# Altium project MotorPower.PrjPcb
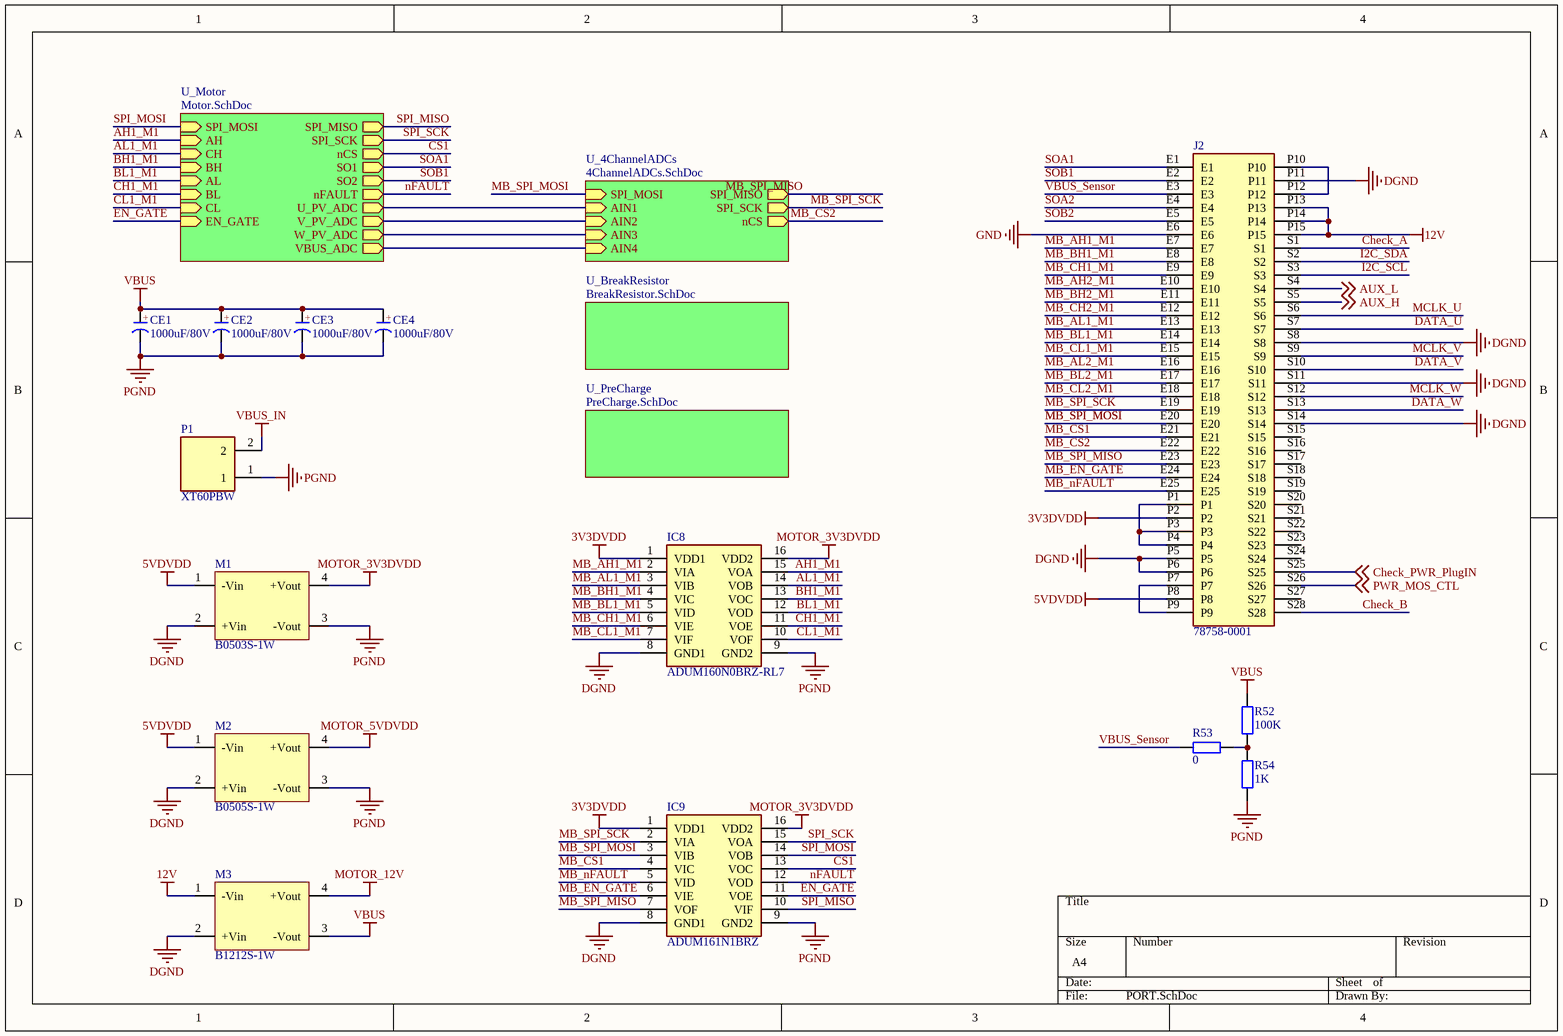
[diagram p0: PORT.SchDoc]
5 sheets, 199 parts. Net scope: hierarchical (ports join the sheet entries above them; power ports are global).
Board file: PowerModule.PcbDoc
Sheets:
  PORT.SchDoc
    U_Motor = Motor.SchDoc
    U_4ChannelADCs = 4ChannelADCs.SchDoc
    U_BreakResistor = BreakResistor.SchDoc
    U_PreCharge = PreCharge.SchDoc

## Sheet PORT.SchDoc
size A4; SheetNumber: 1; SheetTotal: 5

### Parts
CE1  1000uF/80V  [CAP 7.5*18*35.5 - BK]
CE2  1000uF/80V  [CAP 7.5*18*35.5 - BK]
CE3  1000uF/80V  [CAP 7.5*18*35.5 - BK]
CE4  1000uF/80V  [CAP 7.5*18*35.5 - BK]
IC8  ADUM160N0BRZ-RL7  [SOIC127P600X175-16N]
IC9  ADUM161N1BRZ  [SOIC127P600X175-16N]
J2  78758-0001  [78758-0001]
M1  B0503S-1W  [B0505S-1W]
M2  B0505S-1W  [B0505S-1W]
M3  B1212S-1W  [B0505S-1W]
P1  XT60PBW  [XT60]
R52  100K  [R 0603_L]
R53  0  [R 0603_L]
R54  1K  [R 0603_L]

### Sub-sheets
U_4ChannelADCs = 4ChannelADCs.SchDoc: SPI_MOSI (in), SPI_MISO (out), SPI_SCK (out), nCS (out), AIN1 (in), AIN2 (in), AIN3 (in), AIN4 (in)
U_BreakResistor = BreakResistor.SchDoc: no entries
U_Motor = Motor.SchDoc: SPI_MOSI (in), SPI_MISO (out), SPI_SCK (out), AH (in), CH (in), BH (in), AL (in), BL (in), CL (in), nCS (out), SO1 (out), SO2 (out), EN_GATE (in), nFAULT (out), U_PV_ADC (out), V_PV_ADC (out), W_PV_ADC (out), VBUS_ADC (out)
U_PreCharge = PreCharge.SchDoc: no entries

### Nets
3V3DVDD: IC8.1(VDD1) IC9.1(VDD1) J2.P2
5VDVDD: J2.P8 M1.1(-Vin) M2.1(-Vin)
12V: J2.P13 J2.P14 J2.P15 M3.1(-Vin)
DGND: IC8.8(GND1) IC9.8(GND1) J2.P5 J2.P6 J2.P11 J2.S8 J2.S11 J2.S14 M1.2(+Vin) M2.2(+Vin) M3.2(+Vin)
GND: J2.E6
MOTOR_3V3DVDD: IC8.16(VDD2) IC9.16(VDD2) M1.4(+Vout)
MOTOR_5VDVDD: M2.4(+Vout)
MOTOR_12V: M3.4(+Vout)
PGND: CE1.2(K) CE2.2(K) CE3.2(K) CE4.2(K) IC8.9(GND2) IC9.9(GND2) M1.3(-Vout) M2.3(-Vout) P1.1 R54.1  [project net M0_SP1]
VBUS: CE1.1(A) CE2.1(A) CE3.1(A) CE4.1(A) M3.3(-Vout) R52.2
VBUS_IN: P1.2
AH1_M1: IC8.15(VOA) ; sheet U_Motor/AH
AL1_M1: IC8.14(VOB) ; sheet U_Motor/CH
AUX_H: J2.S5 ; off-sheet AUX_H
AUX_L: J2.S4 ; off-sheet AUX_L
BH1_M1: IC8.13(VOC) ; sheet U_Motor/BH
BL1_M1: IC8.12(VOD) ; sheet U_Motor/AL
CH1_M1: IC8.11(VOE) ; sheet U_Motor/BL
Check_A: J2.S1
Check_B: J2.S28
Check_PWR_PlugIN: J2.S25 ; off-sheet Check_PWR_PlugIN
CL1_M1: IC8.10(VOF) ; sheet U_Motor/CL
CS1: IC9.13(VOC) ; sheet U_Motor/nCS
DATA_U: J2.S7
DATA_V: J2.S10
DATA_W: J2.S13
EN_GATE: IC9.11(VOE) ; sheet U_Motor/EN_GATE
I2C_SCL: J2.S3
I2C_SDA: J2.S2
MB_AH1_M1: IC8.2(VIA) J2.E7
MB_AH2_M1: J2.E10
MB_AL1_M1: IC8.3(VIB) J2.E13
MB_AL2_M1: J2.E16
MB_BH1_M1: IC8.4(VIC) J2.E8
MB_BH2_M1: J2.E11
MB_BL1_M1: IC8.5(VID) J2.E14
MB_BL2_M1: J2.E17
MB_CH1_M1: IC8.6(VIE) J2.E9
MB_CH2_M1: J2.E12
MB_CL1_M1: IC8.7(VIF) J2.E15
MB_CL2_M1: J2.E18
MB_CS1: IC9.4(VIC) J2.E21
MB_CS2: J2.E22 ; sheet U_4ChannelADCs/nCS
MB_EN_GATE: IC9.6(VIE) J2.E24
MB_nFAULT: IC9.5(VID) J2.E25
MB_SPI_MISO: IC9.7(VOF) J2.E23 ; sheet U_4ChannelADCs/SPI_MISO
MB_SPI_MOSI: IC9.3(VIB) J2.E20 ; sheet U_4ChannelADCs/SPI_MOSI
MB_SPI_SCK: IC9.2(VIA) J2.E19 ; sheet U_4ChannelADCs/SPI_SCK
MCLK_U: J2.S6
MCLK_V: J2.S9
MCLK_W: J2.S12
nFAULT: IC9.12(VOD) ; sheet U_Motor/nFAULT
PWR_MOS_CTL: J2.S26 ; off-sheet PWR_MOS_CTL
SOA1: J2.E1 ; sheet U_Motor/SO1  [project net SO1]
SOA2: J2.E4
SOB1: J2.E2 ; sheet U_Motor/SO2  [project net SO2]
SOB2: J2.E5
SPI_MISO: IC9.10(VIF) ; sheet U_Motor/SPI_MISO
SPI_MOSI: IC9.14(VOB) ; sheet U_Motor/SPI_MOSI
SPI_SCK: IC9.15(VOA) ; sheet U_Motor/SPI_SCK
U_PV_ADC: sheet U_Motor/U_PV_ADC, sheet U_4ChannelADCs/AIN1
V_PV_ADC: sheet U_Motor/V_PV_ADC, sheet U_4ChannelADCs/AIN2
VBUS_ADC: sheet U_Motor/VBUS_ADC, sheet U_4ChannelADCs/AIN4
VBUS_Sensor: J2.E3 R53.2
W_PV_ADC: sheet U_Motor/W_PV_ADC, sheet U_4ChannelADCs/AIN3
NetJ2_P1: J2.P1 J2.P3 J2.P4
NetJ2_P7: J2.P7 J2.P9
NetJ2_P10: J2.P10 J2.P12
NetR52_1: R52.1 R53.1 R54.2

Not connected (* = marked no-connect by the designer): J2 S15 S16 S17 S18 S19 S20 S21 S22 S23 S24 S27

### Notes on the sheet
- (in symbol CE) +

### Library data of the parts
CE1-CE4 = CE: 直插电解电容
IC8 = ADUM160N0BRZ-RL7: Integrated Circuit; Manufacturer_Name: Analog Devices; Datasheet Link: https://www.analog.com/media/en/technical-documentation/data-sheets/adum160n-161n-162n-163n.pdf; Height: 1.75mm; Manufacturer_Part_Number: ADUM160N0BRZ-RL7; Mouser Part Number: 584-ADUM160N0BRZ-RL7; Mouser Price/Stock: https://www.mouser.co.uk/ProductDetail/Analog-Devices/ADUM160N0BRZ-RL7?qs=cslStgdnz9OW1mXsMBZKfA%3D%3D; Arrow Part Number: ADUM160N0BRZ-RL7; Arrow Price/Stock: https://www.arrow.com/en/products/adum160n0brz-rl7/analog-devices
IC9 = ADUM161N1BRZ: Integrated Circuit; Manufacturer_Name: Analog Devices; Datasheet Link: https://componentsearchengine.com/Datasheets/1/ADUM161N1BRZ.pdf; Height: 1.75mm; Manufacturer_Part_Number: ADUM161N1BRZ; Mouser Part Number: 584-ADUM161N1BRZ; Mouser Price/Stock: https://www.mouser.co.uk/ProductDetail/Analog-Devices/ADUM161N1BRZ?qs=cslStgdnz9PXnDzAofgUAA%3D%3D; Arrow Part Number: ADUM161N1BRZ; Arrow Price/Stock: https://www.arrow.com/en/products/adum161n1brz/analog-devices
J2 = 78758-0001: Connector; Manufacturer_Name: Molex; Manufacturer_Part_Number: 78758-0001; Mouser Part Number: 538-78758-0001; Mouser Price/Stock: https://www.mouser.co.uk/ProductDetail/Molex/78758-0001?qs=wOSGPAwRNAFEK7d2ROR5rw%3D%3D
M1-M3 = B0505S-1W: DC-DC模块; 版权归属: 封装库来自淘宝 ID：黄晶宝石; BOM名称: DC-DC模块; 学习资源: https://shop463601444.taobao.com
R52-R54 = R: 贴片电阻; BOM名称: 贴片电阻

## Sheet Motor.SchDoc
size A3; SheetNumber: 2; SheetTotal: 5
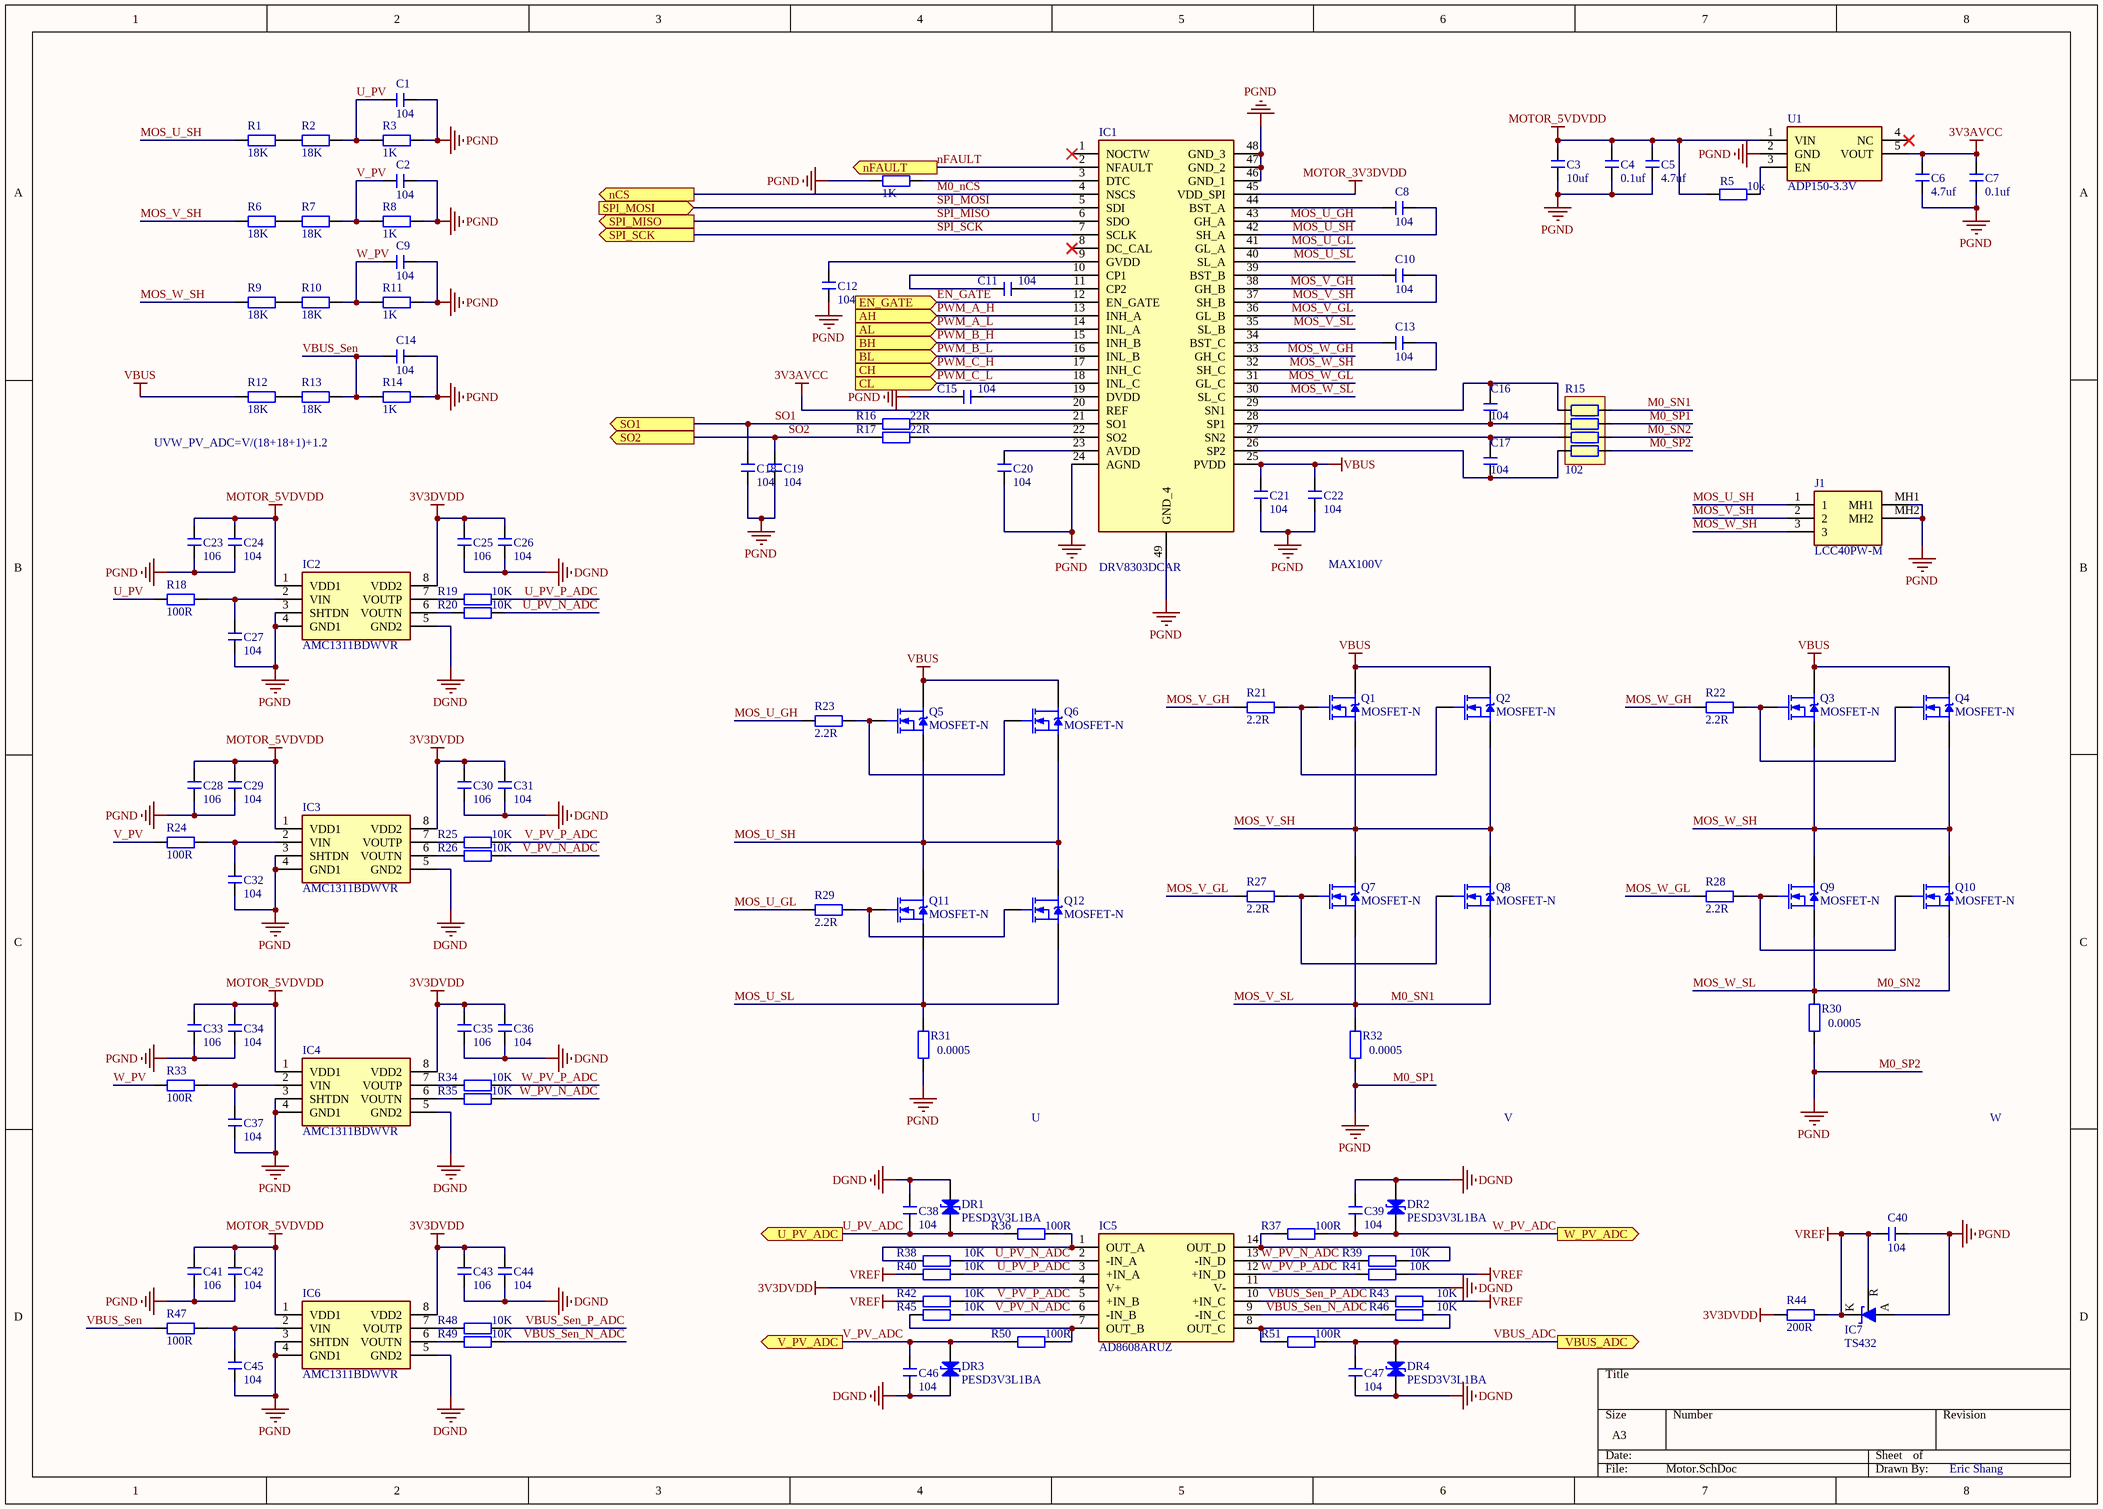
[diagram p1: Motor.SchDoc]

### Parts
C1  104  [C 0603_L]
C2  104  [C 0603_L]
C3  10uf  [C 0805_L]
C4  0.1uf  [C 0805_L]
C5  4.7uf  [C 0805_L]
C6  4.7uf  [C 0805_L]
C7  0.1uf  [C 0805_L]
C8  104  [C 0603_L]
C9  104  [C 0603_L]
C10  104  [C 0603_L]
C11  104  [C 0603_L]
C12  104  [C 0603_L]
C13  104  [C 0603_L]
C14  104  [C 0603_L]
C15  104  [C 0603_L]
C16  104  [C 0603_L]
C17  104  [C 0603_L]
C18  104  [C 0603_L]
C19  104  [C 0603_L]
C20  104  [C 0603_L]
C21  104  [C 0603_L]
C22  104  [C 0603_L]
C23  106  [C 0603_L]
C24  104  [C 0603_L]
C25  106  [C 0603_L]
C26  104  [C 0603_L]
C27  104  [C 0603_L]
C28  106  [C 0603_L]
C29  104  [C 0603_L]
C30  106  [C 0603_L]
C31  104  [C 0603_L]
C32  104  [C 0603_L]
C33  106  [C 0603_L]
C34  104  [C 0603_L]
C35  106  [C 0603_L]
C36  104  [C 0603_L]
C37  104  [C 0603_L]
C38  104  [C 0603_L]
C39  104  [C 0603_L]
C40  104  [C 0603_L]
C41  106  [C 0603_L]
C42  104  [C 0603_L]
C43  106  [C 0603_L]
C44  104  [C 0603_L]
C45  104  [C 0603_L]
C46  104  [C 0603_L]
C47  104  [C 0603_L]
DR1  PESD3V3L1BA  [DO-15]
DR2  PESD3V3L1BA  [DO-15]
DR3  PESD3V3L1BA  [DO-15]
DR4  PESD3V3L1BA  [DO-15]
IC1  DRV8303DCAR  [SOP50P810X120-49N]
IC2  AMC1311BDWVR  [SOIC127P1150X280-8N]
IC3  AMC1311BDWVR  [SOIC127P1150X280-8N]
IC4  AMC1311BDWVR  [SOIC127P1150X280-8N]
IC5  AD8608ARUZ  [SOP65P640X120-14N]
IC6  AMC1311BDWVR  [SOIC127P1150X280-8N]
IC7  TS432  [SOT23-3N]
J1  LCC40PW-M  [LCC40PWM]
Q1  MOSFET-N  [TO263-3B]
Q2  MOSFET-N  [TO263-3B]
Q3  MOSFET-N  [TO263-3B]
Q4  MOSFET-N  [TO263-3B]
Q5  MOSFET-N  [TO263-3B]
Q6  MOSFET-N  [TO263-3B]
Q7  MOSFET-N  [TO263-3B]
Q8  MOSFET-N  [TO263-3B]
Q9  MOSFET-N  [TO263-3B]
Q10  MOSFET-N  [TO263-3B]
Q11  MOSFET-N  [TO263-3B]
Q12  MOSFET-N  [TO263-3B]
R1  18K  [R 0603_L]
R2  18K  [R 0603_L]
R3  1K  [R 0603_L]
R4  1K  [R 0603_L]
R5  10k  [0805_R]
R6  18K  [R 0603_L]
R7  18K  [R 0603_L]
R8  1K  [R 0603_L]
R9  18K  [R 0603_L]
R10  18K  [R 0603_L]
R11  1K  [R 0603_L]
R12  18K  [R 0603_L]
R13  18K  [R 0603_L]
R14  1K  [R 0603_L]
R15  102  [RCA-8P4R-0603]
R16  22R  [R 0603_L]
R17  22R  [R 0603_L]
R18  100R  [R 0603_L]
R19  10K  [R 0603_L]
R20  10K  [R 0603_L]
R21  2.2R  [R 0603_L]
R22  2.2R  [R 0603_L]
R23  2.2R  [R 0603_L]
R24  100R  [R 0603_L]
R25  10K  [R 0603_L]
R26  10K  [R 0603_L]
R27  2.2R  [R 0603_L]
R28  2.2R  [R 0603_L]
R29  2.2R  [R 0603_L]
R30  0.0005  [R 2512_M]
R31  0.0005  [R 2512_M]
R32  0.0005  [R 2512_M]
R33  100R  [R 0603_L]
R34  10K  [R 0603_L]
R35  10K  [R 0603_L]
R36  100R  [R 0603_L]
R37  100R  [R 0603_L]
R38  10K  [R 0603_L]
R39  10K  [R 0603_L]
R40  10K  [R 0603_L]
R41  10K  [R 0603_L]
R42  10K  [R 0603_L]
R43  10K  [R 0603_L]
R44  200R  [R 0603_L]
R45  10K  [R 0603_L]
R46  10K  [R 0603_L]
R47  100R  [R 0603_L]
R48  10K  [R 0603_L]
R49  10K  [R 0603_L]
R50  100R  [R 0603_L]
R51  100R  [R 0603_L]
U1  ADP150-3.3V

### Ports
AH (in), AL (in), BH (in), BL (in), CH (in), CL (in), EN_GATE (in), nCS (out), nFAULT (out), SO1 (out), SO2 (out), SPI_MISO (out), SPI_MOSI (in), SPI_SCK (out), U_PV_ADC (out), V_PV_ADC (out), VBUS_ADC (out), W_PV_ADC (out)

### Nets
3V3AVCC: C6.2 C7.2 IC1.20(REF) U1.5(VOUT)
3V3DVDD: C25.2 C26.2 C30.2 C31.2 C35.2 C36.2 C43.2 C44.2 IC2.8(VDD2) IC3.8(VDD2) IC4.8(VDD2) IC5.4(V+) IC6.8(VDD2) R44.1
DGND: C25.1 C26.1 C30.1 C31.1 C35.1 C36.1 C38.1 C39.1 C43.1 C44.1 C46.2 C47.2 DR1.1(A) DR2.1(A) DR3.2(K) DR4.2(K) IC2.5(GND2) IC3.5(GND2) IC4.5(GND2) IC5.11(V-) IC6.5(GND2)
M0_SP1: C1.2 C2.2 C3.1 C4.1 C5.1 C6.1 C7.1 C9.2 C12.1 C14.2 C15.1 C18.2 C19.2 C20.2 C21.2 C22.2 C23.1 C24.1 C27.1 C28.1 C29.1 C32.1 C33.1 C34.1 C37.1 C40.1 C41.1 C42.1 C45.1 IC1.24(AGND) IC1.46(GND_1) IC1.47(GND_2) IC1.48(GND_3) IC1.49(GND_4) IC2.3(SHTDN) IC2.4(GND1) IC3.3(SHTDN) IC3.4(GND1) IC4.3(SHTDN) IC4.4(GND1) IC6.3(SHTDN) IC6.4(GND1) IC7.3(A) J1.MH1 J1.MH2 R3.2 R4.1 R8.2 R11.2 R14.2 R15.5 R15.7 R30.1 R31.1 R32.1 U1.2(GND)  [also labelled M0_SP2, PGND]
MOTOR_3V3DVDD: IC1.45(VDD_SPI)
MOTOR_5VDVDD: C3.2 C4.2 C5.2 C23.2 C24.2 C28.2 C29.2 C33.2 C34.2 C41.2 C42.2 IC2.1(VDD1) IC3.1(VDD1) IC4.1(VDD1) IC6.1(VDD1) R5.1 U1.1(VIN)
VBUS: C21.1 C22.1 IC1.25(PVDD) Q1.2(D) Q2.2(D) Q3.2(D) Q4.2(D) Q5.2(D) Q6.2(D) R12.1
VREF: C40.2 IC7.1(R) IC7.2(K) R40.2 R41.1 R42.1 R43.2 R44.2
EN_GATE: IC1.12(EN_GATE) ; port EN_GATE
M0_nCS: IC1.4(NSCS) ; port nCS  [project net CS1]
M0_SN1: IC1.35(SL_B) Q7.3(S) Q8.3(S) R15.8 R32.2  [also labelled MOS_V_SL]
M0_SN2: IC1.30(SL_C) Q9.3(S) Q10.3(S) R15.6 R30.2  [also labelled MOS_W_SL]
MOS_U_GH: IC1.43(GH_A) R23.1
MOS_U_GL: IC1.41(GL_A) R29.1
MOS_U_SH: C8.2 IC1.42(SH_A) J1.1 Q5.3(S) Q6.3(S) Q11.2(D) Q12.2(D) R1.1
MOS_U_SL: IC1.40(SL_A) Q11.3(S) Q12.3(S) R31.2
MOS_V_GH: IC1.38(GH_B) R21.1
MOS_V_GL: IC1.36(GL_B) R27.1
MOS_V_SH: C10.2 IC1.37(SH_B) J1.2 Q1.3(S) Q2.3(S) Q7.2(D) Q8.2(D) R6.1
MOS_W_GH: IC1.33(GH_C) R22.1
MOS_W_GL: IC1.31(GL_C) R28.1
MOS_W_SH: C13.2 IC1.32(SH_C) J1.3 Q3.3(S) Q4.3(S) Q9.2(D) Q10.2(D) R9.1
nFAULT: IC1.2(NFAULT) ; port nFAULT
PWM_A_H: IC1.13(INH_A) ; port AH  [project net AH1_M1]
PWM_A_L: IC1.14(INL_A) ; port AL  [project net BL1_M1]
PWM_B_H: IC1.15(INH_B) ; port BH  [project net BH1_M1]
PWM_B_L: IC1.16(INL_B) ; port BL  [project net CH1_M1]
PWM_C_H: IC1.17(INH_C) ; port CH  [project net AL1_M1]
PWM_C_L: IC1.18(INL_C) ; port CL  [project net CL1_M1]
SO1: C18.1 R16.1 ; port SO1
SO2: C19.1 R17.1 ; port SO2
SPI_MISO: IC1.6(SDO) ; port SPI_MISO
SPI_MOSI: IC1.5(SDI) ; port SPI_MOSI
SPI_SCK: IC1.7(SCLK) ; port SPI_SCK
U_PV: C1.1 R2.2 R3.1 R18.1
U_PV_ADC: C38.2 DR1.2(K) R36.2 ; port U_PV_ADC
U_PV_N_ADC: IC5.2(-IN_A) R20.1 R38.2
U_PV_P_ADC: IC5.3(+IN_A) R19.1 R40.1
V_PV: C2.1 R7.2 R8.1 R24.1
V_PV_ADC: C46.1 DR3.1(A) R50.2 ; port V_PV_ADC
V_PV_N_ADC: IC5.6(-IN_B) R26.1 R45.1
V_PV_P_ADC: IC5.5(+IN_B) R25.1 R42.2
VBUS_ADC: C47.1 DR4.1(A) R51.1 ; port VBUS_ADC
VBUS_Sen: C14.1 R13.2 R14.1 R47.1
VBUS_Sen_N_ADC: IC5.9(-IN_C) R46.2 R49.1
VBUS_Sen_P_ADC: IC5.10(+IN_C) R43.1 R48.1
W_PV: C9.1 R10.2 R11.1 R33.1
W_PV_ADC: C39.2 DR2.2(K) R37.1 ; port W_PV_ADC
W_PV_N_ADC: IC5.13(-IN_D) R35.1 R39.1
W_PV_P_ADC: IC5.12(+IN_D) R34.1 R41.2
NetC8_1: C8.1 IC1.44(BST_A)
NetC10_1: C10.1 IC1.39(BST_B)
NetC11_1: C11.1 IC1.10(CP1)
NetC11_2: C11.2 IC1.11(CP2)
NetC12_2: C12.2 IC1.9(GVDD)
NetC13_1: C13.1 IC1.34(BST_C)
NetC15_2: C15.2 IC1.19(DVDD)
NetC16_1: C16.1 IC1.28(SP1) R15.2
NetC16_2: C16.2 IC1.29(SN1) R15.1
NetC17_1: C17.1 IC1.26(SP2) R15.4
NetC17_2: C17.2 IC1.27(SN2) R15.3
NetC20_1: C20.1 IC1.23(AVDD)
NetC27_2: C27.2 IC2.2(VIN) R18.2
NetC32_2: C32.2 IC3.2(VIN) R24.2
NetC37_2: C37.2 IC4.2(VIN) R33.2
NetC45_2: C45.2 IC6.2(VIN) R47.2
NetIC1_3: IC1.3(DTC) R4.2
NetIC1_21: IC1.21(SO1) R16.2
NetIC1_22: IC1.22(SO2) R17.2
NetIC2_6: IC2.6(VOUTN) R20.2
NetIC2_7: IC2.7(VOUTP) R19.2
NetIC3_6: IC3.6(VOUTN) R26.2
NetIC3_7: IC3.7(VOUTP) R25.2
NetIC4_6: IC4.6(VOUTN) R35.2
NetIC4_7: IC4.7(VOUTP) R34.2
NetIC5_1: IC5.1(OUT_A) R36.1 R38.1
NetIC5_7: IC5.7(OUT_B) R45.2 R50.1
NetIC5_8: IC5.8(OUT_C) R46.1 R51.2
NetIC5_14: IC5.14(OUT_D) R37.2 R39.2
NetIC6_6: IC6.6(VOUTN) R49.2
NetIC6_7: IC6.7(VOUTP) R48.2
NetQ1_1: Q1.1(G) Q2.1(G) R21.2
NetQ3_1: Q3.1(G) Q4.1(G) R22.2
NetQ5_1: Q5.1(G) Q6.1(G) R23.2
NetQ7_1: Q7.1(G) Q8.1(G) R27.2
NetQ9_1: Q9.1(G) Q10.1(G) R28.2
NetQ11_1: Q11.1(G) Q12.1(G) R29.2
NetR1_2: R1.2 R2.1
NetR5_2: R5.2 U1.3(EN)
NetR6_2: R6.2 R7.1
NetR9_2: R9.2 R10.1
NetR12_2: R12.2 R13.1

Not connected (* = marked no-connect by the designer): IC1 1(NOCTW)* 8(DC_CAL)*; U1 4(NC)*

### Notes on the sheet
- UVW_PV_ADC=V/(18+18+1)+1.2
- MAX100V
- U
- V
- W
- Eric Shang

### Library data of the parts
C1-C47 = C: 贴片电容; BOM名称: 无极性贴片电容
DR1-DR4 = DR: 瞬态电压抑制二极管; 版权归属: 封装库来自淘宝 ID：黄晶宝石; BOM名称: 瞬态电压抑制二极管; 学习资源: https://shop463601444.taobao.com
IC1 = DRV8303DCAR: Integrated Circuit; Manufacturer_Name: Texas Instruments; Datasheet Link: http://www.ti.com/lit/gpn/drv8303; Height: 1.2mm; Manufacturer_Part_Number: DRV8303DCAR; Mouser Part Number: 595-DRV8303DCAR; Mouser Price/Stock: https://www.mouser.co.uk/ProductDetail/Texas-Instruments/DRV8303DCAR?qs=igp4D3uu33JOvU%2FdrzSIMA%3D%3D; Arrow Part Number: DRV8303DCAR; Arrow Price/Stock: https://www.arrow.com/en/products/drv8303dcar/texas-instruments
IC2-IC4 IC6 = AMC1311BDWVR: Integrated Circuit; Manufacturer_Name: Texas Instruments; Datasheet Link: http://www.ti.com/lit/gpn/amc1311; Height: 2.8mm; Manufacturer_Part_Number: AMC1311BDWVR; Mouser Part Number: 595-AMC1311BDWVR; Mouser Price/Stock: https://www.mouser.co.uk/ProductDetail/Texas-Instruments/AMC1311BDWVR?qs=W0yvOO0ixfFQekR98E4CkQ%3D%3D; Arrow Part Number: AMC1311BDWVR; Arrow Price/Stock: https://www.arrow.com/en/products/amc1311bdwvr/texas-instruments?region=nac
IC5 = AD8608ARUZ: Integrated Circuit; Manufacturer_Name: Analog Devices; Datasheet Link: http://www.analog.com/media/en/technical-documentation/data-sheets/AD8605_8606_8608.pdf; Height: 1.2mm; Manufacturer_Part_Number: AD8608ARUZ; Mouser Part Number: 584-AD8608ARUZ; Mouser Price/Stock: https://www.mouser.co.uk/ProductDetail/Analog-Devices/AD8608ARUZ?qs=%2FtpEQrCGXCxg3nNHNwXPVQ%3D%3D; Arrow Part Number: AD8608ARUZ; Arrow Price/Stock: https://www.arrow.com/en/products/ad8608aruz/analog-devices?region=europe
IC7 = TL431_SMD: 可调基准稳压芯片; 版权归属: 封装库来自淘宝 ID：黄晶宝石; BOM名称: 可调基准稳压芯片; 学习资源: https://shop463601444.taobao.com
J1 = LCC40PW-M: Connector; Manufacturer_Name: Amass; Datasheet Link: https://www.li-force.ru/uploads/entity/lcc40pw-m-2023v2.pdf; Height: 13.65mm; Manufacturer_Part_Number: LCC40PW-M
Q1-Q12 = MOSFET-N: N-Channel MOSFET; PackageDocument: 1995/1996; Published: 8-Jun-2000; LatestRevisionDate: 17-Jul-2002; LatestRevisionNote: Re-released for DXP Platform.; PackageReference: E3; Publisher: Altium Limited
R1-R4 R6-R14 R16-R51 = R: 贴片电阻; BOM名称: 贴片电阻
R5 = 0805 电阻: 贴片电阻 0805 电阻; ComponentLink1Description: 供应商链接; ComponentLink1URL: http://www.szlcsc.com/product/details_18165.html; Package: 0805; Supplier: LC; SuppliersPartNumber: C17477
R15 = R-8P4R: 贴片排阻; BOM名称: 贴片网络排阻; 版权归属: 封装库来自淘宝 ID：黄晶宝石; 联系售后: https://shop463601444.taobao.com
U1 = ADP150: IOVDD needs 1.8V

## Sheet 4ChannelADCs.SchDoc
size A4; SheetNumber: 4; SheetTotal: 5
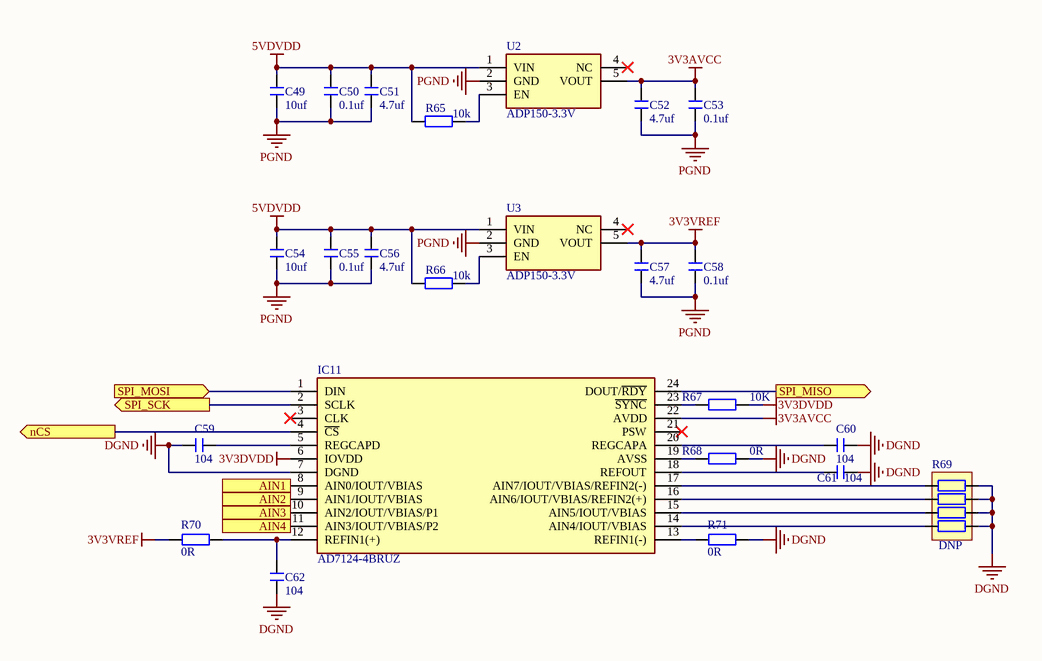
[diagram p2: 4ChannelADCs.SchDoc]

### Parts
C49  10uf  [C 0805_L]
C50  0.1uf  [C 0805_L]
C51  4.7uf  [C 0805_L]
C52  4.7uf  [C 0805_L]
C53  0.1uf  [C 0805_L]
C54  10uf  [C 0805_L]
C55  0.1uf  [C 0805_L]
C56  4.7uf  [C 0805_L]
C57  4.7uf  [C 0805_L]
C58  0.1uf  [C 0805_L]
C59  104  [C 0603_L]
C60  104  [C 0603_L]
C61  104  [C 0603_L]
C62  104  [C 0603_L]
IC11  AD7124-4BRUZ  [SOP65P640X120-24N]
R65  10k  [0805_R]
R66  10k  [0805_R]
R67  10K  [R 0603_L]
R68  0R  [R 0603_L]
R69  DNP  [RCA-8P4R-0603]
R70  0R  [R 0603_L]
R71  0R  [R 0603_L]
U2  ADP150-3.3V
U3  ADP150-3.3V

### Ports
AIN1 (in), AIN2 (in), AIN3 (in), AIN4 (in), nCS (out), SPI_MISO (out), SPI_MOSI (in), SPI_SCK (out)

### Nets
3V3AVCC: C52.2 C53.2 IC11.22(AVDD) U2.5(VOUT)
3V3DVDD: IC11.6(IOVDD) R67.1
3V3VREF: C57.2 C58.2 R70.2 U3.5(VOUT)
5VDVDD: C49.2 C50.2 C51.2 C54.2 C55.2 C56.2 R65.1 R66.1 U2.1(VIN) U3.1(VIN)
DGND: C59.1 C60.1 C61.1 C62.1 IC11.7(DGND) R68.1 R69.5 R69.6 R69.7 R69.8 R71.1
PGND: C49.1 C50.1 C51.1 C52.1 C53.1 C54.1 C55.1 C56.1 C57.1 C58.1 U2.2(GND) U3.2(GND)  [project net M0_SP1]
MB_CS2: IC11.4(~{CS}) ; port nCS
MB_SPI_MISO: IC11.24(DOUT/~{RDY}) ; port SPI_MISO
MB_SPI_MOSI: IC11.1(DIN) ; port SPI_MOSI
MB_SPI_SCK: IC11.2(SCLK) ; port SPI_SCK
U_PV_ADC: IC11.8(AIN0/IOUT/VBIAS) ; port AIN1
V_PV_ADC: IC11.9(AIN1/IOUT/VBIAS) ; port AIN2
VBUS_ADC: IC11.11(AIN3/IOUT/VBIAS/P2) ; port AIN4
W_PV_ADC: IC11.10(AIN2/IOUT/VBIAS/P1) ; port AIN3
NetC59_2: C59.2 IC11.5(REGCAPD)
NetC60_2: C60.2 IC11.20(REGCAPA)
NetC61_2: C61.2 IC11.18(REFOUT)
NetC62_2: C62.2 IC11.12(REFIN1(+)) R70.1
NetIC11_13: IC11.13(REFIN1(-)) R71.2
NetIC11_14: IC11.14(AIN4/IOUT/VBIAS) R69.4
NetIC11_15: IC11.15(AIN5/IOUT/VBIAS) R69.3
NetIC11_16: IC11.16(AIN6/IOUT/VBIAS/REFIN2(+)) R69.2
NetIC11_17: IC11.17(AIN7/IOUT/VBIAS/REFIN2(-)) R69.1
NetIC11_19: IC11.19(AVSS) R68.2
NetIC11_23: IC11.23(~{SYNC}) R67.2
NetR65_2: R65.2 U2.3(EN)
NetR66_2: R66.2 U3.3(EN)

Not connected (* = marked no-connect by the designer): IC11 3(CLK)* 21(PSW)*; U2 4(NC)*; U3 4(NC)*

### Library data of the parts
C49-C62 = C: 贴片电容; BOM名称: 无极性贴片电容
IC11 = AD7124-4BRUZ: Integrated Circuit; Manufacturer_Name: Analog Devices; Datasheet Link: http://www.analog.com/media/en/technical-documentation/data-sheets/AD7124-4.pdf; Height: 1.2mm; Manufacturer_Part_Number: AD7124-4BRUZ; Mouser Part Number: 584-AD7124-4BRUZ; Mouser Price/Stock: https://www.mouser.co.uk/ProductDetail/Analog-Devices/AD7124-4BRUZ?qs=8Sj0zgMuDMVqCrsELALuFg%3D%3D; Arrow Part Number: AD7124-4BRUZ; Arrow Price/Stock: https://www.arrow.com/en/products/ad7124-4bruz/analog-devices?region=nac
R65 R66 = 0805 电阻: 贴片电阻 0805 电阻; ComponentLink1Description: 供应商链接; ComponentLink1URL: http://www.szlcsc.com/product/details_18165.html; Package: 0805; Supplier: LC; SuppliersPartNumber: C17477
R67 R68 R70 R71 = R: 贴片电阻; BOM名称: 贴片电阻
R69 = R-8P4R: 贴片排阻; BOM名称: 贴片网络排阻
U2 U3 = ADP150: IOVDD needs 1.8V

## Sheet BreakResistor.SchDoc
size A4; SheetNumber: 3; SheetTotal: 5
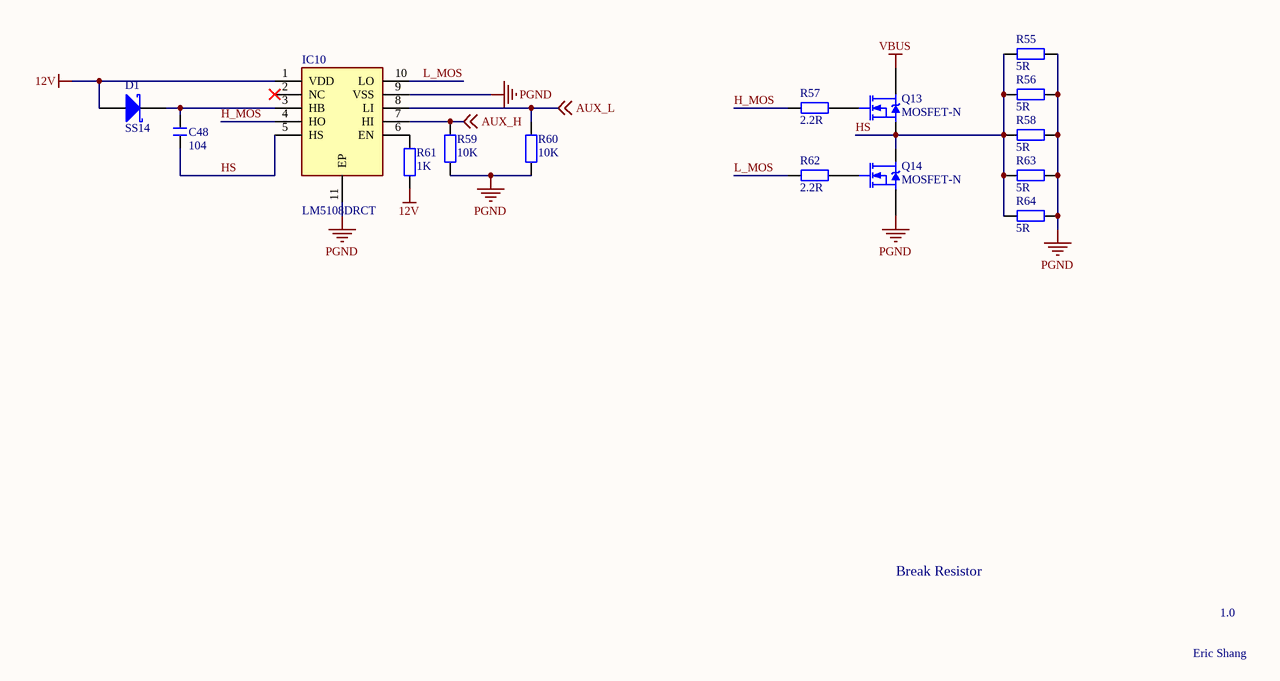
[diagram p3: BreakResistor.SchDoc]

### Parts
C48  104  [C 0603_L]
D1  SS14  [SMA]
IC10  LM5108DRCT  [SON50P300X300X100-11N-D]
Q13  MOSFET-N  [TO263-3B]
Q14  MOSFET-N  [TO263-3B]
R55  5R  [RX10-18*15*5]
R56  5R  [RX10-18*15*5]
R57  2.2R  [R 0603_L]
R58  5R  [RX10-18*15*5]
R59  10K  [R 0603_L]
R60  10K  [R 0603_L]
R61  1K  [R 0603_L]
R62  2.2R  [R 0603_L]
R63  5R  [RX10-18*15*5]
R64  5R  [RX10-18*15*5]

### Nets
12V: D1.1(A) IC10.1(VDD) R61.2
PGND: IC10.9(VSS) IC10.11(EP) Q14.3(S) R55.2 R56.2 R58.2 R59.2 R60.2 R63.2 R64.2  [project net M0_SP1]
VBUS: Q13.2(D)
AUX_H: IC10.7(HI) R59.1 ; off-sheet AUX_H
AUX_L: IC10.8(LI) R60.1 ; off-sheet AUX_L
H_MOS: IC10.4(HO) R57.1
HS: C48.1 IC10.5(HS) Q13.3(S) Q14.2(D) R55.1 R56.1 R58.1 R63.1 R64.1
L_MOS: IC10.10(LO) R62.1
NetC48_2: C48.2 D1.2(K) IC10.3(HB)
NetIC10_6: IC10.6(EN) R61.1
NetQ13_1: Q13.1(G) R57.2
NetQ14_1: Q14.1(G) R62.2

Not connected (* = marked no-connect by the designer): IC10 2(NC)*

### Notes on the sheet
- Break Resistor
- 1.0
- Eric Shang

### Library data of the parts
C48 = C: 贴片电容; BOM名称: 无极性贴片电容; 淘宝ID: 封装库来自淘宝 ID：黄晶宝石; 联系售后，技术支持: https://shop463601444.taobao.com; 唯一出售店铺网址: https://shop463601444.taobao.com
D1 = SS14: 肖特基二极管; 属性: 40V/1A; BOM名称: 肖特基二极管; 封装库来自淘宝 ID：黄晶宝石: https://shop463601444.taobao.com
IC10 = LM5108DRCT: Integrated Circuit; Manufacturer_Name: Texas Instruments; Datasheet Link: http://www.ti.com/lit/gpn/LM5108; Height: 1mm; Manufacturer_Part_Number: LM5108DRCT; Mouser Part Number: 595-LM5108DRCT; Mouser Price/Stock: https://www.mouser.co.uk/ProductDetail/Texas-Instruments/LM5108DRCT?qs=T3oQrply3y%2FzIxTRQrXrXQ%3D%3D; Arrow Part Number: LM5108DRCT; Arrow Price/Stock: https://www.arrow.com/en/products/lm5108drct/texas-instruments?region=nac
Q13 Q14 = MOSFET-N: as Q1 on sheet Motor; Published: 8-Jun-2000; LatestRevisionDate: 17-Jul-2002; LatestRevisionNote: Re-released for DXP Platform.; PackageReference: E3; Publisher: Altium Limited
R55 R56 R58 R63 R64 = R_MPR: 5W无感水泥电阻; BOM名称: 大功率电阻; 版权归属: 封装库来自淘宝 ID：黄晶宝石; 联系售后: https://shop463601444.taobao.com
R57 R59-R62 = R: 贴片电阻; 版权归属: 来自淘宝 ID：黄晶宝石; 封装库来自淘宝卖家 ID：黄晶宝石: 其他店铺购入均为盗版，不享受售后技术支持服务，请立即申请退款; BOM名称: 贴片电阻; 联系售后: https://shop463601444.taobao.com

## Sheet PreCharge.SchDoc
size A4; SheetNumber: 5; SheetTotal: 5
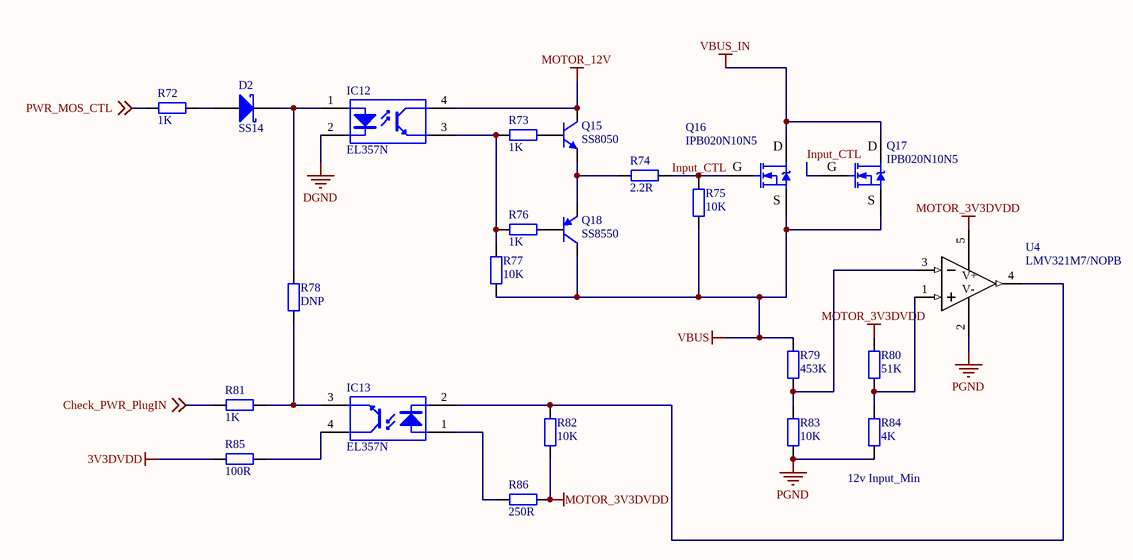
[diagram p4: PreCharge.SchDoc]

### Parts
D2  SS14  [SMA]
IC12  EL357N  [DIP4-300]
IC13  EL357N  [DIP4-300]
Q15  SS8050  [SOT23-3N]
Q16  IPB020N10N5  [TO252]
Q17  IPB020N10N5  [TO252]
Q18  SS8550  [SOT23-3N]
R72  1K  [R 0603_L]
R73  1K  [R 0603_L]
R74  2.2R  [R 0603_L]
R75  10K  [R 0603_L]
R76  1K  [R 0603_L]
R77  10K  [R 0603_L]
R78  DNP  [R 0603_L]
R79  453K  [R 0603_L]
R80  51K  [R 0603_L]
R81  1K  [R 0603_L]
R82  10K  [R 0603_L]
R83  10K  [R 0603_L]
R84  4K  [R 0603_L]
R85  100R  [R 0603_L]
R86  250R  [R 0603_L]
U4  LMV321M7/NOPB  [MAA05A]

### Nets
3V3DVDD: R85.1
DGND: IC12.2(K)
MOTOR_3V3DVDD: R80.1 R82.2 R86.1 U4.5(V+)
MOTOR_12V: IC12.4(C) Q15.3(C)
PGND: R83.2 R84.2 U4.2(V-)  [project net M0_SP1]
VBUS: Q16.2(S) Q17.2(S) Q18.3(C) R75.2 R77.2 R79.1
VBUS_IN: Q16.3(D) Q17.3(D)
Check_PWR_PlugIN: R81.2 ; off-sheet Check_PWR_PlugIN
Input_CTL: Q16.1(G) Q17.1(G) R74.1 R75.1
PWR_MOS_CTL: R72.2 ; off-sheet PWR_MOS_CTL
NetD2_1: D2.1(A) R72.1
NetD2_2: D2.2(K) IC12.1(A) R78.1
NetIC12_3: IC12.3(E) R73.2 R76.2 R77.1
NetIC13_1: IC13.1(A) R86.2
NetIC13_2: IC13.2(K) R82.1 U4.4(OUT)
NetIC13_3: IC13.3(E) R78.2 R81.1
NetIC13_4: IC13.4(C) R85.2
NetQ15_1: Q15.1(B) R73.1
NetQ15_2: Q15.2(E) Q18.2(E) R74.2
NetQ18_1: Q18.1(B) R76.1
NetR79_2: R79.2 R83.1 U4.3(IN-)
NetR80_2: R80.2 R84.1 U4.1(IN+)

### Notes on the sheet
- (near R84) 12v Input_Min

### Library data of the parts
D2 = SS14: 肖特基二极管; 属性: 40V/1A; BOM名称: 肖特基二极管; 封装库来自淘宝 ID：黄晶宝石: https://shop463601444.taobao.com
IC12 IC13 = EL357N: 线性光耦; 版权归属: 封装库来自淘宝 ID：黄晶宝石; BOM名称: 线性光耦; 学习资源: https://shop463601444.taobao.com
Q15 = 8050-SMD: 高频放大-NPN型; 版权归属: 封装库来自淘宝 ID：黄晶宝石; 属性: 40V 1.5A 1W 100MHZ; BOM名称: 高频放大-NPN型; 联系售后: https://shop463601444.taobao.com
Q16 Q17 = SI2302: N沟道场效应管; BOM名称: N沟道场效应管
Q18 = 8550-SMD: 高频放大-PNP型; 版权归属: 封装库来自淘宝 ID：黄晶宝石; 属性: 40V 1.5A 1W 100MHZ; BOM名称: 高频放大-PNP型; 学习资源: www.ooocke.com
R72-R86 = R: 贴片电阻; BOM名称: 贴片电阻
U4 = LMV321M7/NOPB: No Description Available; Mfr_Name: Texas Instruments; Manufacturer: NationalSemiconductor; Characteristics: LMV321M7GeneralPurposeLowVoltageR-ROut1MHzSingleOpAmpTiny; CompType: OpAmpIC; TaMin_C: -400; TaMax_C: 850; ComponentLink1DescBC: LMV321Datasheet; ComponentLink2DescA4: LMV321WebPage; ComponentLink3DescAC: MAA05APackageWebPage; Copyright: Copyright (C) 2023 Ultra Librarian. All rights reserved.; Manufacturer_Part_Number: LMV321M7/NOPB; Digi-Key_Part_Number_1: LMV321M7/NOPBCT-ND; Digi-Key_Part_Number_2: LMV321M7/NOPBDKR-ND; Digi-Key_Part_Number_3: LMV321M7/NOPBTR-ND; Digi-Key_Part_Number_4: 2156-LMV321M7/NOPB-ND; RefDes: RefDes; Type: DEV; SymbolVersion: 2008-07-09; PartNumber: LMV321M7; PackageDescription: 5LeadSC-70; PackageReference: MAA05A_L; RoHS: O; ComponentLink1URL: http//wwwnationalcom/ds/LM/LMV321pdf; ComponentLink2URL: http//wwwnationalcom/pf/LM/LMV321html; ComponentLink3URL: http//wwwnationalcom/packaging/folders/maa05ahtml; Version: B1608; LatestRevisionDate: 2009-03-16; LatestRevisionNote: MassUpdate; Publisher: NationalSemiconductor; Published: 2009-03-16

## Nets that join several sheets
3V3AVCC: Motor (C6.2 C7.2 IC1.20 U1.5), 4ChannelADCs (C52.2 C53.2 IC11.22 U2.5)
3V3DVDD: PORT (IC8.1 IC9.1 J2.P2), Motor (14 pins), 4ChannelADCs (IC11.6 R67.1), PreCharge (R85.1)
5VDVDD: PORT (J2.P8 M1.1 M2.1), 4ChannelADCs (10 pins)
12V: PORT (J2.P13 J2.P14 J2.P15 M3.1), BreakResistor (D1.1 IC10.1 R61.2)
DGND: PORT (11 pins), Motor (21 pins), 4ChannelADCs (11 pins), PreCharge (IC12.2)
M0_SP1: PORT (10 pins), Motor (56 pins), 4ChannelADCs (12 pins), BreakResistor (10 pins), PreCharge (R83.2 R84.2 U4.2)
MOTOR_3V3DVDD: PORT (IC8.16 IC9.16 M1.4), Motor (IC1.45), PreCharge (R80.1 R82.2 R86.1 U4.5)
MOTOR_5VDVDD: PORT (M2.4), Motor (17 pins)
MOTOR_12V: PORT (M3.4), PreCharge (IC12.4 Q15.3)
VBUS: PORT (6 pins), Motor (10 pins), BreakResistor (Q13.2), PreCharge (6 pins)
VBUS_IN: PORT (P1.2), PreCharge (Q16.3 Q17.3)
AH1_M1: PORT (IC8.15), Motor (IC1.13)
AL1_M1: PORT (IC8.14), Motor (IC1.17)
BH1_M1: PORT (IC8.13), Motor (IC1.15)
BL1_M1: PORT (IC8.12), Motor (IC1.14)
CH1_M1: PORT (IC8.11), Motor (IC1.16)
CL1_M1: PORT (IC8.10), Motor (IC1.18)
CS1: PORT (IC9.13), Motor (IC1.4)
EN_GATE: PORT (IC9.11), Motor (IC1.12)
MB_CS2: PORT (J2.E22), 4ChannelADCs (IC11.4)
MB_SPI_MISO: PORT (IC9.7 J2.E23), 4ChannelADCs (IC11.24)
MB_SPI_MOSI: PORT (IC9.3 J2.E20), 4ChannelADCs (IC11.1)
MB_SPI_SCK: PORT (IC9.2 J2.E19), 4ChannelADCs (IC11.2)
nFAULT: PORT (IC9.12), Motor (IC1.2)
SO1: PORT (J2.E1), Motor (C18.1 R16.1)
SO2: PORT (J2.E2), Motor (C19.1 R17.1)
SPI_MISO: PORT (IC9.10), Motor (IC1.6)
SPI_MOSI: PORT (IC9.14), Motor (IC1.5)
SPI_SCK: PORT (IC9.15), Motor (IC1.7)
U_PV_ADC: Motor (C38.2 DR1.2 R36.2), 4ChannelADCs (IC11.8)
V_PV_ADC: Motor (C46.1 DR3.1 R50.2), 4ChannelADCs (IC11.9)
VBUS_ADC: Motor (C47.1 DR4.1 R51.1), 4ChannelADCs (IC11.11)
W_PV_ADC: Motor (C39.2 DR2.2 R37.1), 4ChannelADCs (IC11.10)